# Altium schematic sheet Power_Management.SchDoc
size A4; SheetNumber: 2; SheetTotal: 11
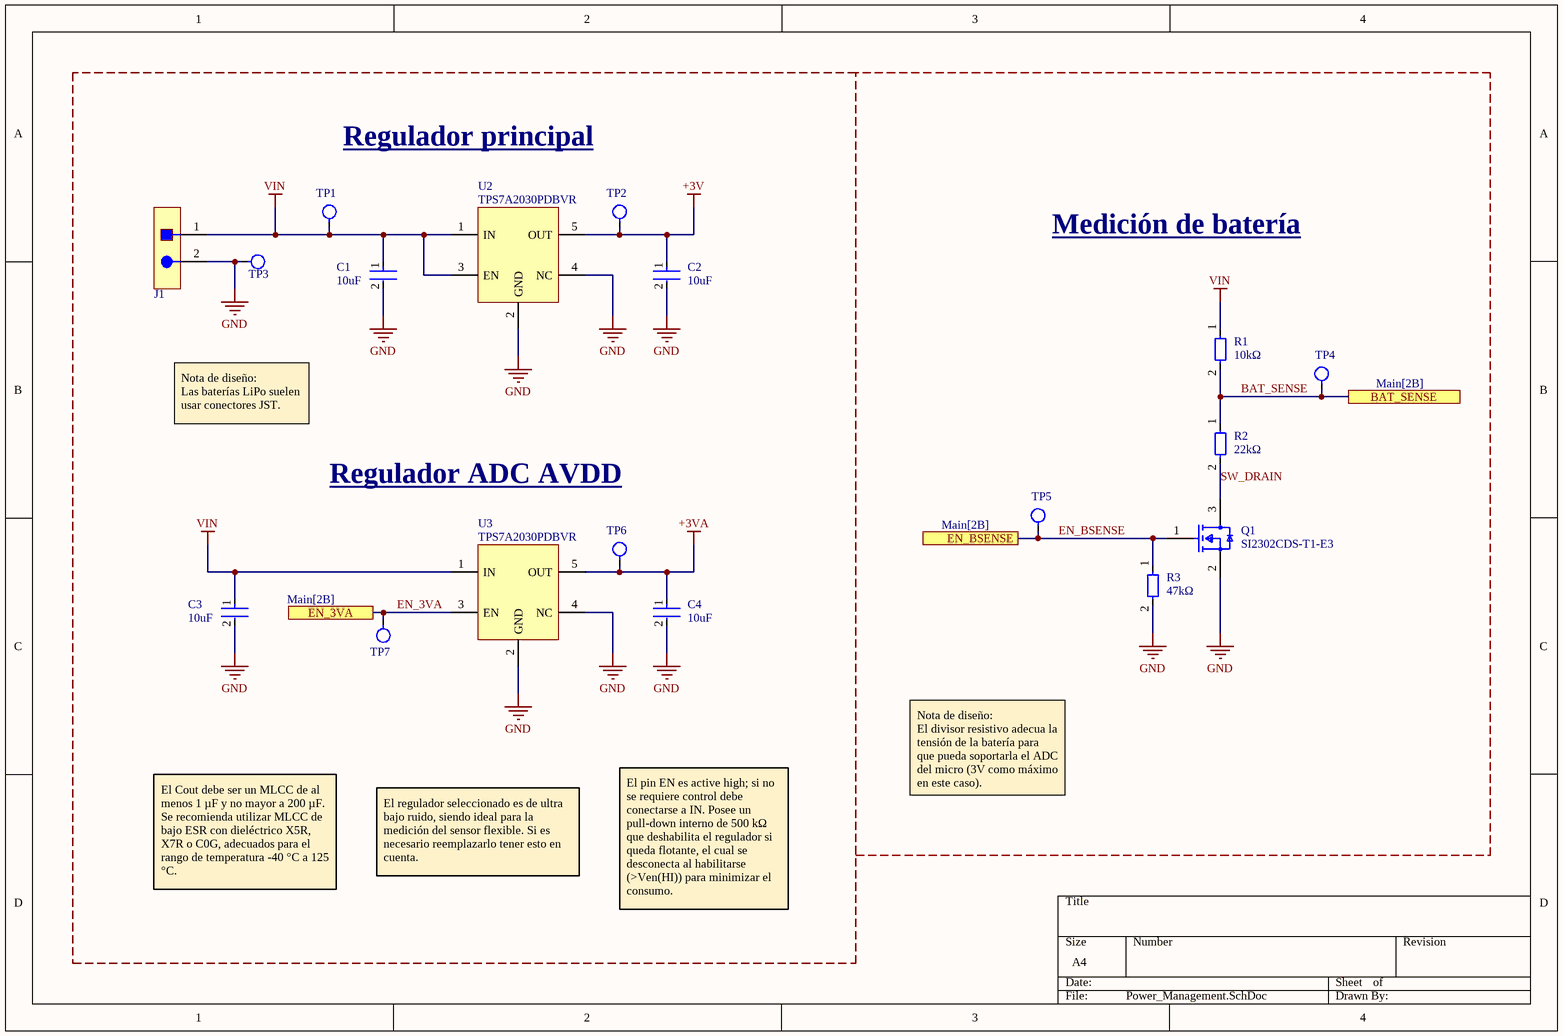
[diagram p0: Power_Management.SchDoc]

## Parts
C1  10uF  [CAP_0603]
C2  10uF  [CAP_0603]
C3  10uF  [CAP_0603]
C4  10uF  [CAP_0603]
J1  JST CONN  [JST_B2B-PH-K-S]  (value not drawn)
Q1  SI2302CDS-T1-E3  [FP-S-03946-MFG]
R1  value 10kΩ  [RES_0603]  (hidden comment: 10k)
R2  value 22kΩ  [RES_0603]  (hidden comment: 22k)
R3  value 47kΩ  [RES_0603]  (hidden comment: 47k)
TP1  Testpoint SMD  [Testpoint_SMD]  (value not drawn)  (no BOM)
TP2  Testpoint SMD  [Testpoint_SMD]  (value not drawn)  (no BOM)
TP3  Testpoint SMD  [Testpoint_SMD]  (value not drawn)  (no BOM)
TP4  Testpoint SMD  [Testpoint_SMD]  (value not drawn)  (no BOM)
TP5  Testpoint SMD  [Testpoint_SMD]  (value not drawn)  (no BOM)
TP6  Testpoint SMD  [Testpoint_SMD]  (value not drawn)  (no BOM)
TP7  Testpoint SMD  [Testpoint_SMD]  (value not drawn)  (no BOM)
U2  TPS7A2030PDBVR  [SOT-23]
U3  TPS7A2030PDBVR  [SOT-23]

## Ports
BAT_SENSE (see Main[2B]), EN_3VA (see Main[2B]), EN_BSENSE (see Main[2B])

## Nets
+3V: C2.1 TP2.1 U2.5(OUT)
+3VA: C4.1 TP6.1 U3.5(OUT)
GND: C1.2 C2.2 C3.2 C4.2 J1.2 Q1.2(S) R3.2 TP3.1 U2.2(GND) U2.4(NC) U3.2(GND) U3.4(NC)
VIN: C1.1 C3.1 J1.1 R1.1 TP1.1 U2.1(IN) U2.3(EN) U3.1(IN)
BAT_SENSE: R1.2 R2.1 TP4.1 ; port BAT_SENSE
EN_3VA: TP7.1 U3.3(EN) ; port EN_3VA
EN_BSENSE: Q1.1(G) R3.1 TP5.1 ; port EN_BSENSE
SW_DRAIN: Q1.3(D) R2.2

## Notes on the sheet
- Regulador principal
- Medición de batería
- Nota de diseño:
  Las baterías LiPo suelen usar conectores JST.
- Regulador ADC AVDD
- Nota de diseño:
  El divisor resistivo adecua la tensión de la batería para que pueda soportarla el ADC del micro (3V como máximo en este caso).
- El Cout debe ser un MLCC de al menos 1 µF y no mayor a 200 µF. Se recomienda utilizar MLCC de bajo ESR con dieléctrico X5R, X7R o C0G, adecuados para el rango de temperatura -40 °C a 125 °C.
- El regulador seleccionado es de ultra bajo ruido, siendo ideal para la medición del sensor flexible. Si es necesario reemplazarlo tener esto en cuenta.
- El pin EN es active high; si no se requiere control debe conectarse a IN. Posee un pull-down interno de 500 kΩ que deshabilita el regulador si queda flotante, el cual se desconecta al habilitarse (>Ven(HI)) para minimizar el consumo.

## Library data of the parts
C1-C4 = Generic C: Cap 10 uF 10V X7R 0603; Dielectric: X5R; Tolerance: 10%; Case Code (Imperial): 0805; Capacitance: 10uF; Mount: Surface Mount; Depth: 1.25mm; Length: 2mm; Lead Free: Lead Free; Packaging: Tape and Reel; Width: 0.049inch; Package Quantity: 1; Height: 1.25mm; Case/Package: 0805; Voltage Rating: 10V; Thickness: 0.053inch; Max Operating Temperature: 85°C; Case Code (Metric): 2012; Contact Plating: Tin; Min Operating Temperature: -55°C; Radiation Hardening: No; Voltage Rating (DC): 10V
J1 = B2B-PH-K-S: CONN JST HEADER VERT 2POS 2MM for LIPO batteries.
Q1 = CMP-02550-000184-1: MOSFET N-CH 20V 2.6A SOT-23; Manufacturer: Vishay; Gate To Source Voltage: 8V; Max Forward Diode Voltage: 1.2V; Pulse Drain Current: 10A; Typ Forward Diode Voltage: 0.7V; Number Of N Channels: 1; Reverse Recovery Charge: 2nC; Power Dissipation: 0.71W; Reverse Recovery Time: 8.5ns; Threshold Vgs Min: 0.4V; Drain To Source Resistance: 0.045Ω; Gate Charge At Vgs: 3.5nC @ 4.5V; Turn Off Delay Time: 30ns; Rthja Max: 140°C/W; Max Junction Temp: +150°C; Transconductance: 13S; Depletion Mode: False; Standoff Height: 0.01mm; Turn On Delay Time: 8ns; Threshold Vgs Max: 0.85V; Manufacturer Part Number: SI2302CDS-T1-E3; Mouser Description: MOSFET 20V 2.9A 0.86W 57mohm @ 4.5V; Digikey Description: MOSFET N-CH 20V 2.6A SOT-23; Drain To Source Voltage: 20V; Lead Free: Yes; Temperature Range High: +150°C; Automotive: No; ComponentLink2URL: http://www.vishay.com/docs/68645/si2302cds.pdf; Height: 1.12mm; ComponentLink2Description: Datasheet; Octopart: https://octopart.com/si2302cds-t1-e3-vishay-44452855; Continuous Drain Current: 2.6A; Drain To Source Breakdown Voltage: 20V; Number Of Channels: 1; Device Class L3: MOSFETs; Device Class L1: Discrete Semiconductors; Temperature Range Low: -55°C; Package: S-03946; RoHS: TRUE; Device Class L2: Transistors; Temperature: -55°C to +150°C; Category: Trans
R1 = Generic R: RES  10k 1% 0603
R2 = Generic R: RES  22k 1% 0603
R3 = Generic R: RES  47k 1% 0603
TP1-TP7 = Testpoint_SMD: Testpoint SMD de 1mm de diametro.
U2 U3 = TPS7A2030PDBVR: IC REG LINEAR 3V 300MA SOT23-5